# EAGLE design aquarium.computer (EAGLE 6.5.0)
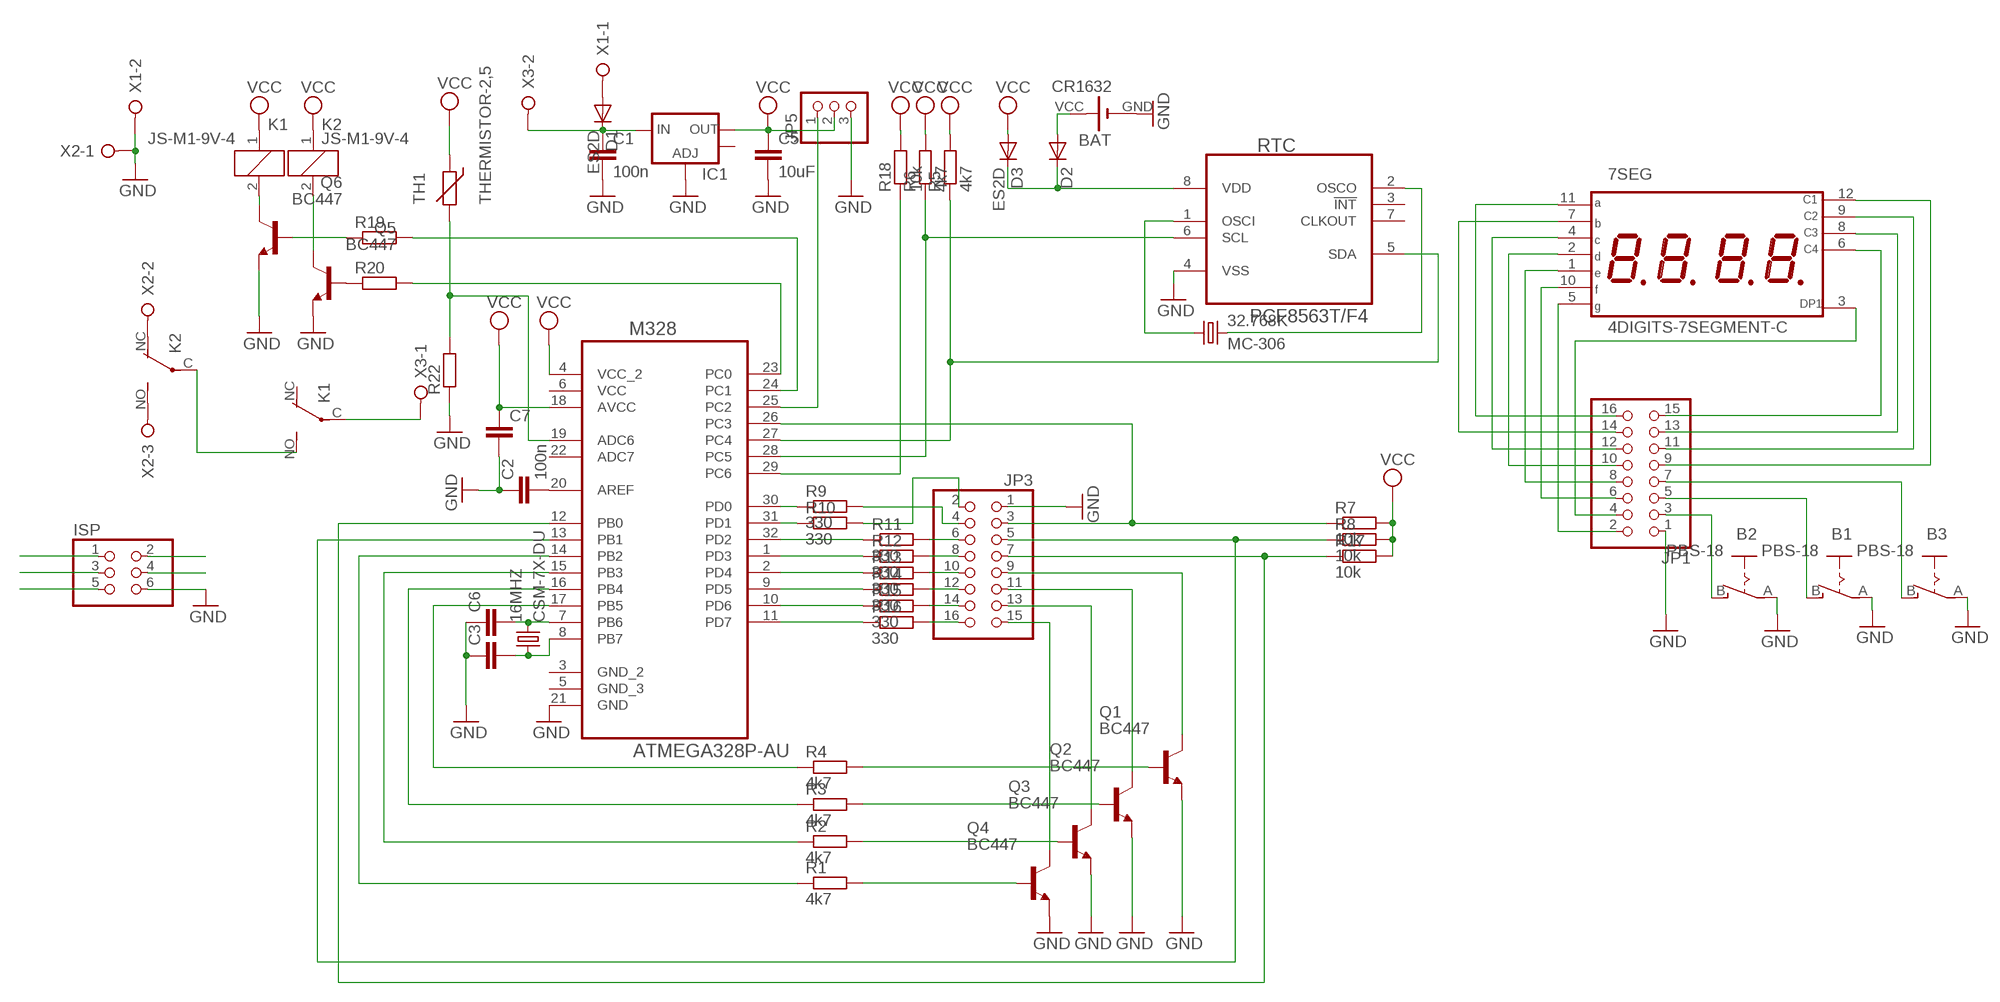
[diagram p0: schematic, sheet 1]

## Parts
7SEG  4DIGITS-7SEGMENT-C  [CC56-12EWA]
16MHZ  CSM-7X-DU  [CSM-7X-DU]
32.768K  MC-306  [MC-306]
B1  PBS-18  [PBS18]
B2  PBS-18  [PBS18]
B3  PBS-18  [PBS18]
BAT  CR1632  [CR3232]
C1  100n  C-EU025-040X050  [C025-040X050]
C2  100n  C-EUC1206  [C1206]
C3  C-EUC0805K  [C0805K]
C5  10uF  C-EU025-050X050  [C025-050X050]
C6  C-EUC0805K  [C0805K]
C7  C-EU025-040X050  [C025-040X050]
D1  ES2D  [SMB]
D2  DIODE-SOD80C  [SOD80C]
D3  ES2D  [SMB]
IC1  V_REG_LM1117SOT223  [SOT223]
ISP  PINHD-2X3  [2X03]
JP1  PINHD-2X8  [2X08]
JP3  PINHD-2X8  [2X08]
JP5  PINHD-1X3  [1X03]
K1  JS-M1-9V-4  [JS-M]
K2  JS-M1-9V-4  [JS-M]
M328  ATMEGA328P-AU  [QFP80P900X900X120-32N]
Q1  BC447  [TO92-EBC]
Q2  BC447  [TO92-EBC]
Q3  BC447  [TO92-EBC]
Q4  BC447  [TO92-EBC]
Q5  BC447  [TO92-EBC]
Q6  BC447  [TO92-EBC]
R1  4k7  R-EU_0207/10  [0207/10]
R2  4k7  R-EU_0207/10  [0207/10]
R3  4k7  R-EU_0207/10  [0207/10]
R4  4k7  R-EU_0207/10  [0207/10]
R5  4k7  R-EU_R1206  [R1206]
R6  4k7  R-EU_R1206  [R1206]
R7  10k  R-EU_0207/10  [0207/10]
R8  10k  R-EU_0207/10  [0207/10]
R9  330  R-EU_0207/10  [0207/10]
R10  330  R-EU_0207/10  [0207/10]
R11  330  R-EU_0207/10  [0207/10]
R12  330  R-EU_0207/10  [0207/10]
R13  330  R-EU_0207/10  [0207/10]
R14  330  R-EU_0207/10  [0207/10]
R15  330  R-EU_0207/10  [0207/10]
R16  330  R-EU_0207/10  [0207/10]
R17  10k  R-EU_0207/10  [0207/10]
R18  10k  R-EU_0207/10  [0207/10]
R19  R-EU_0207/10  [0207/10]
R20  R-EU_0207/10  [0207/10]
R22  R-EU_R1206  [R1206]
RTC  PCF8563T/F4  [SOIC127P600X175-8N]
TH1  THERMISTOR-2,5  [RS-2,5]
X1  W237-02P  [W237-132]
X2  W237-3E  [W237-3E]
X3  W237-02P  [W237-132]

## Nets
GND: B1.A(P) B2.A(P) B3.A(P) BAT.GND(-) C1.2 C2.1 C3.1 C5.2 C6.1 C7.2 IC1.1(ADJ) ISP.6 JP1.1 JP3.1 JP5.3 M328.21(GND) Q1.E Q2.E Q3.E Q4.E Q5.E Q6.E R22.1 RTC.4(VSS) X1.2 X2.1
MISO: ISP.1 M328.16(PB4) R3.1
MOSI: ISP.4 M328.15(PB3) R2.1
N$1: M328.28(PC5) R6.1 RTC.6(SCL)
N$2: M328.27(PC4) R5.1 RTC.5(SDA)
N$3: Q5.B R20.1
N$4: Q1.B R4.2
N$5: Q2.B R3.2
N$6: Q3.B R2.2
N$7: M328.31(PD1) R10.1
N$8: M328.32(PD2) R11.1
N$9: M328.1(PD3) R12.1
N$10: M328.2(PD4) R13.1
N$11: M328.9(PD5) R14.1
N$12: K1.C(2:P) X3.1
N$13: M328.10(PD6) R15.1
N$14: M328.11(PD7) R16.1
N$15: JP3.7 M328.12(PB0) R17.1
N$16: M328.14(PB2) R1.1
N$17: JP3.2 R10.2
N$18: 32.768K.1 RTC.1(OSCI)
N$19: 32.768K.4 RTC.2(OSCO)
N$20: JP3.4 R9.2
N$22: JP3.6 R11.2
N$23: JP3.8 R12.2
N$24: JP3.10 R13.2
N$25: JP3.12 R14.2
N$26: JP3.14 R15.2
N$27: JP3.16 R16.2
N$28: Q4.B R1.2
N$29: M328.30(PD0) R9.1
N$30: 16MHZ.2 C6.2 M328.7(PB6)
N$31: 16MHZ.1 C3.2 M328.8(PB7)
N$32: 7SEG.11(A) JP1.16
N$33: M328.23(PC0) R20.2
N$34: M328.24(PC1) R19.2
N$35: JP3.3 M328.26(PC3) R7.1
N$36: M328.19(ADC6) R22.2 TH1.2
N$37: JP3.5 M328.13(PB1) R8.1
N$38: JP3.11 Q2.C
N$39: JP3.9 Q1.C
N$40: K2.2 Q5.C
N$41: K1.2 Q6.C
N$42: K1.NO(2:S) K2.C(2:P)
N$43: BAT.VCC(+) D2.A
N$44: 7SEG.7(B) JP1.14
N$45: K2.NC(2:O) X2.2
N$46: K2.NO(2:S) X2.3
N$47: Q6.B R19.1
N$49: B2.B(S) JP1.3
N$50: B1.B(S) JP1.5
N$51: B3.B(S) JP1.7
N$52: 7SEG.10(F) JP1.6
N$53: 7SEG.4(C) JP1.12
N$54: 7SEG.2(D) JP1.10
N$55: 7SEG.1(E) JP1.8
N$56: 7SEG.5(G) JP1.2
N$57: 7SEG.6(C4) JP1.15
N$58: 7SEG.12(C1) JP1.9
N$59: 7SEG.9(C2) JP1.11
N$60: 7SEG.8(C3) JP1.13
N$61: 7SEG.3(DP1) JP1.4
N$62: JP3.15 Q4.C
N$63: JP3.13 Q3.C
N$66: C2.2 M328.20(AREF)
N$67: D2.C D3.C RTC.8(VDD)
N$68: JP5.1 M328.25(PC2)
N$73: C1.1 D1.C IC1.3(IN) X3.2
N$74: D1.A X1.1
RESET: ISP.5 M328.29(PC6) R18.1
SCK: ISP.3 M328.17(PB5) R4.1
VCC: C5.1 C7.1 D3.A IC1.2(OUT) ISP.2 JP5.2 K1.1 K2.1 M328.4(VCC_2) M328.18(AVCC) R5.2 R6.2 R7.2 R8.2 R17.2 R18.2 TH1.1
Unconnected: IC1.4(OUT) K1.NC(2:O) M328.3(GND_2) M328.5(GND_3) M328.22(ADC7) RTC.3(!INT) RTC.7(CLKOUT)

## Power pins joined to a net without a drawn wire
VCC: M328.6(VCC)

## Library data of the parts
7SEG = display-kingbright:4DIGITS-7SEGMENT-C
16MHZ = quarz:CSM-7X-DU: SMD CRYSTAL Source: www.ecsxtal.com .. Crystal 3.6864MHz CSM_7X_DU.PDF; OC_FARNELL: unknown; OC_NEWARK: unknown
32.768K = quarz:MC-306: kHz RANGE CRYSTAL UNIT SMD Source: MC-306_405_406_E07X.PDF Homepage <www.epsontoyocom.co.jp>; MPN: MC-306 60.0KHZ 100PPM ,12.5PF; OC_FARNELL: 1278040; OC_NEWARK: 31M5576
B1-B3 = switch:PBS-18
BAT = battery:CR1632
C1-C3 C5-C7 = rcl:C-EU: CAPACITOR, European symbol
D1 D3 = diode:ES2D: DIODE super fast rectifier, 2 A
D2 = diode:DIODE-: DIODE
IC1 = sparkfun:V_REG_LM1117: Voltage Regulator LM1117 Standard adjustable voltage regulator but in SMD form. Spark Fun Electronics SKU : COM-00595
ISP = pinhead:PINHD-2X3: PIN HEADER
JP1 JP3 = pinhead:PINHD-2X8: PIN HEADER
JP5 = pinhead:PINHD-1X3: PIN HEADER
K1 K2 = relay:JS-M1*: Automotive Ultra-Miniature Power Relay NAiS Source: http://www.mew-europe.com/.. en_ds_61211_0000.pdf; OC_FARNELL: unknown; OC_NEWARK: unknown
M328 = atmega328:ATMEGA328P-AU: 8-bit Microcontroller with In-System Programmable Flash; MPN: ATMEGA328P-AU; OC_FARNELL: 1715486; OC_NEWARK: 14R4631; PACKAGE: TQFP-32; SUPPLIER: Atmel
Q1-Q6 = transistor-npn:BC447*: NPN Transistor
R1-R20 R22 = rcl:R-EU_: RESISTOR, European symbol
RTC = pcf8563:PCF8563T/F4: IC, RTC/CALENDAR, SMD, 8563, SOIC8; MPN: PCF8563T/F4; OC_FARNELL: 2064561; OC_NEWARK: 71T7091; PACKAGE: SOIC-8; SUPPLIER: NXP Semiconductors
TH1 = varistor:THERMISTOR: THERMISTOR
X1 X3 = con-wago-508:W237-02P: WAGO SREW CLAMP; OC_FARNELL: unknown; OC_NEWARK: unknown
X2 = con-wago-508:W237-3E: WAGO SREW CLAMP; OC_FARNELL: unknown; OC_NEWARK: unknown

## Net classes
0 default: width 0.406 mm, drill 0.406 mm, clearance 0.406 mm
1 GND: width 0.61 mm, drill 0.61 mm, clearance 0.61 mm

## Board
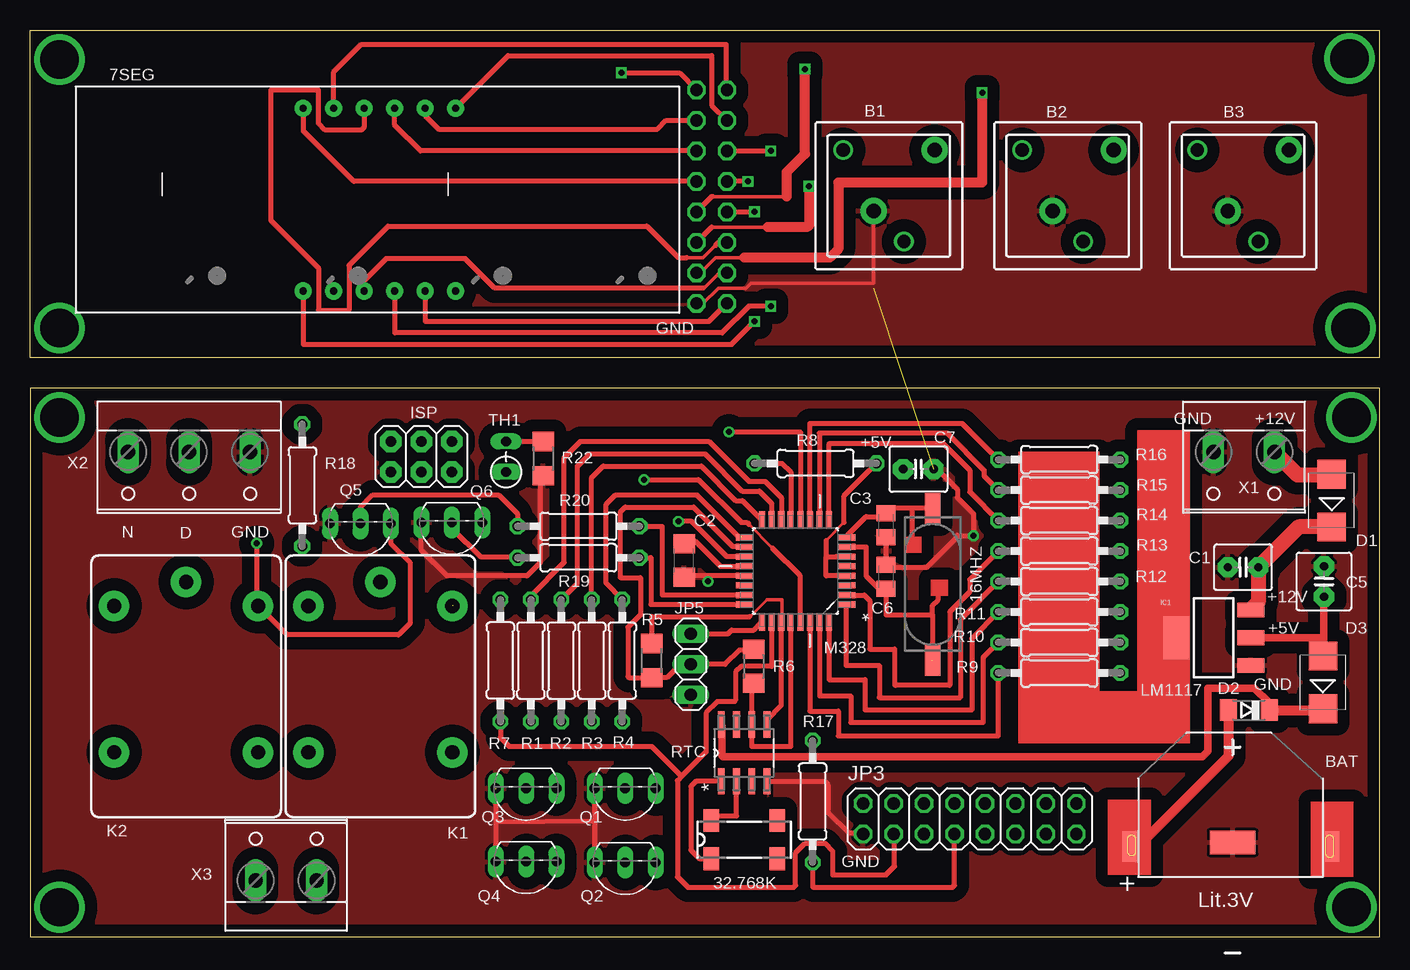
[diagram p1: board, top side]
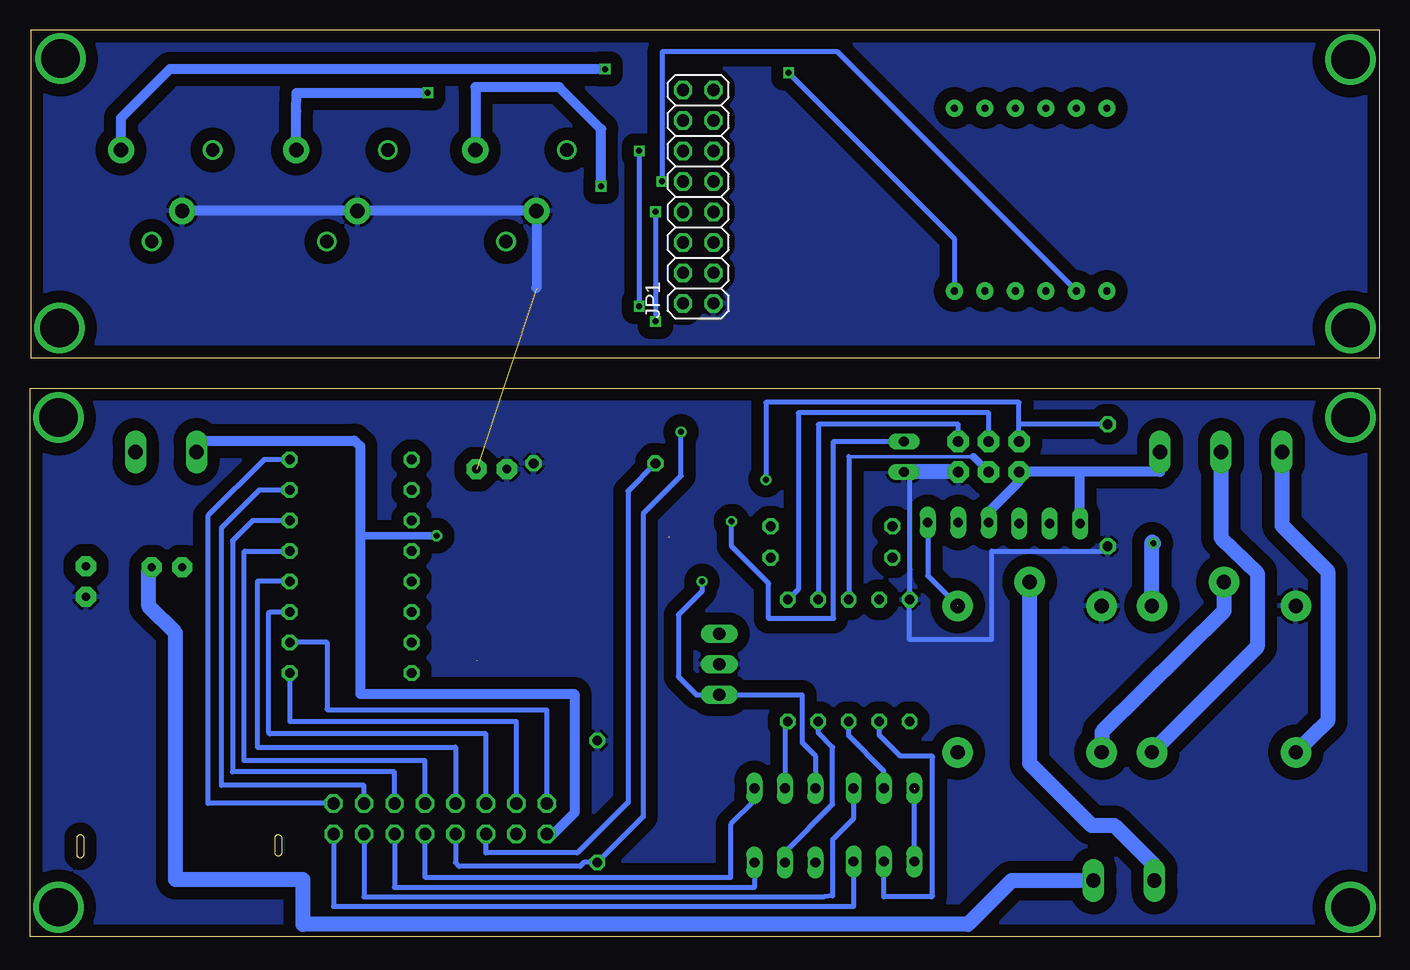
[diagram p2: board, bottom side, seen from below]

Size 112.54 x 75.56 mm. Coordinates in mm from the lower left corner, seen from the top.
Outline: 0,0 112.54,0 112.54,45.71 0,45.71 0,0
Outline: 0,48.26 0,75.57 112.47,75.57 112.47,48.26 0,48.26
Copper layers (1*16): Top 0.035mm / dielectric 1.5mm / Bottom 0.035mm
Design rules "default": minimum track width 10mil, minimum drill 24mil, track to track 8mil, track to pad 8mil, pad to pad 8mil, via to via 8mil, smd to smd 8mil, copper to edge 40mil, drill to drill 8mil, minimum pad ring 10mil, minimum via ring 8mil, stop-mask expansion 4mil, vias tented up to drill 0mil, thermal gap 10mil

### Footprints (pad centres in the part's own frame; a part is rotated, then mirrored left to right if it is on the bottom)
CC56-12EWA = drill 0.6 pad 1.422: 1 13.97,-5.715; 2 16.51,-5.715; 3 19.05,-5.715; 4 21.59,-5.715; 5 24.13,-5.715; 6 26.67,-5.715; 7 26.67,9.525; 8 24.13,9.525; 9 21.59,9.525; 10 19.05,9.525; 11 16.51,9.525; 12 13.97,9.525
CSM-7X-DU = smd 2.54 x 1.27: 1 -6.338,0; 2 6.338,0
MC-306 = smd 1.3 x 1.9: 1 -2.75,-1.6; 2 2.75,-1.6; 3 2.75,1.6; 4 -2.75,1.6
PBS18 = drill 1.2 pad 2.184: A 0,0; B 5.095,5.075 | drill 1.1 pad 1.27: P$1 -2.54,5.08; P$2 2.54,-2.54
CR3232 = smd 3.81 x 1.93: GND 0,-0.953 | smd 1.27 x 2.54: VCC -8.572,-1.27; VCC1 8.255,-1.27
C025-040X050 = drill 0.7 pad 1.676 octagon: 1 -1.27,0; 2 1.27,0
C1206 = smd 1.6 x 1.8: 1 -1.4,0; 2 1.4,0
C0805K = smd 1.3 x 1.6: 1 -1,0; 2 1,0
C025-050X050 = drill 0.7 pad 1.676 octagon: 1 -1.27,0; 2 1.27,0
SMB = smd 2.4 x 2.4: A 2.2,0; C -2.2,0
SOD80C = smd 1.4 x 1.8: A 1.7,0; C -1.7,0
SOT223 = smd 1.219 x 2.235: 1 -2.311,-3.099; 2 0,-3.099; 3 2.311,-3.099 | smd 3.6 x 2.2: 4 0,3.099
2X03 = drill 0.9 pad 1.778 octagon: 1 -2.54,-1.27; 2 -2.54,1.27; 3 0,-1.27; 4 0,1.27; 5 2.54,-1.27; 6 2.54,1.27
2X08 = drill 1.016 octagon: 1 -8.89,-1.27; 2 -8.89,1.27; 3 -6.35,-1.27; 4 -6.35,1.27; 5 -3.81,-1.27; 6 -3.81,1.27; 7 -1.27,-1.27; 8 -1.27,1.27; 9 1.27,-1.27; 10 1.27,1.27; 11 3.81,-1.27; 12 3.81,1.27; 13 6.35,-1.27; 14 6.35,1.27; 15 8.89,-1.27; 16 8.89,1.27
1X03 = drill 1.016 long: 1 -2.54,0; 2 0,0; 3 2.54,0
JS-M = drill 1.2 pad 2.54: 1 6.7,6; 2 6.7,-6; C 8.7,0; NC -5.5,-6; NO -5.5,6
QFP80P900X900X120-32N = smd 1.473 x 0.508: 1 -4.242,2.794; 2 -4.242,2.007; 3 -4.242,1.194; 4 -4.242,0.406; 5 -4.242,-0.406; 6 -4.242,-1.194; 7 -4.242,-2.007; 8 -4.242,-2.794; 17 4.242,-2.794; 18 4.242,-2.007; 19 4.242,-1.194; 20 4.242,-0.406; 21 4.242,0.406; 22 4.242,1.194; 23 4.242,2.007; 24 4.242,2.794 | smd 0.508 x 1.473: 9 -2.794,-4.242; 10 -2.007,-4.242; 11 -1.194,-4.242; 12 -0.406,-4.242; 13 0.406,-4.242; 14 1.194,-4.242; 15 2.007,-4.242; 16 2.794,-4.242; 25 2.794,4.242; 26 2.007,4.242; 27 1.194,4.242; 28 0.406,4.242; 29 -0.406,4.242; 30 -1.194,4.242; 31 -2.007,4.242; 32 -2.794,4.242
TO92-EBC = drill 0.813 long: B 0,-1.27; C -2.54,-1.27; E 2.54,-1.27
0207/10 = drill 0.813 octagon: 1 -5.08,0; 2 5.08,0
R1206 = smd 1.6 x 1.803: 1 -1.422,0; 2 1.422,0
SOIC127P600X175-8N = smd 2.184 x 0.559: 1 -2.362,1.905; 2 -2.362,0.635; 3 -2.362,-0.635; 4 -2.362,-1.905; 5 2.362,-1.905; 6 2.362,-0.635; 7 2.362,0.635; 8 2.362,1.905
RS-2,5 = drill 0.813 long: 1 -1.27,0; 2 1.27,0
W237-132 = drill 1.194 long: 1 -2.54,-0.635; 2 2.54,-0.635
W237-3E = drill 1.194 long: 1 -5.08,-0.635; 2 0,-0.635; 3 5.08,-0.635

### Placement (x,y rotation side)
7SEG  8.81,59.53 0 top
16MHZ  75.25,29.37 270 top
32.768K  59.53,8.1 0 top
B1  70.33,60.48 0 top
B2  85.25,60.48 0 top
B3  99.85,60.48 0 top
BAT  100.25,8.81 0 top
C1  101.12,30.8 180 top
C2  54.53,31.35 90 top
C3  71.36,34.29 90 top
C5  107.87,29.61 90 top
C6  71.36,30 270 top
C7  74.06,38.97 0 top
D1  108.51,36.35 90 top
D2  101.6,18.89 180 top
D3  107.79,21.19 90 top
IC1  98.66,24.92 90 top
ISP  32.62,40 180 top
JP1  56.83,61.67 90 bottom
JP3  78.34,9.84 0 top
JP5  55.09,22.7 270 top
K1  29.21,20.88 90 top
K2  13.02,20.88 90 top
M328  63.82,30.48 180 top
Q1  49.61,11.11 180 top
Q2  49.61,4.92 180 top
Q3  41.35,11.11 180 top
Q4  41.35,5 180 top
Q5  27.54,33.18 180 top
Q6  35.16,33.26 180 top
R1  41.75,23.02 270 top
R2  44.29,23.02 270 top
R3  46.83,23.02 270 top
R4  49.37,23.02 270 top
R5  51.83,23.02 270 top
R6  60.33,22.54 90 top
R7  39.21,23.02 90 top
R8  65.48,39.45 0 top
R9  85.8,21.99 0 top
R10  85.8,24.53 0 top
R11  85.8,27.07 0 top
R12  85.8,29.61 0 top
R13  85.8,32.15 0 top
R14  85.8,34.69 0 top
R15  85.8,37.23 0 top
R16  85.8,39.77 0 top
R17  65.25,11.27 90 top
R18  22.7,37.62 270 top
R19  45.72,31.59 0 top
R20  45.72,34.21 0 top
R22  42.78,39.85 90 top
RTC  59.53,15.32 90 top
TH1  39.69,40 90 top
X1  101.2,39.77 180 top
X2  13.26,39.77 180 top
X3  21.35,5.32 0 top

### Tracks (layer width: path | path; a pad name or v marks a point on that pad's centre or on a via)
GND  (via drill 0.5 pad 0.61)  (2 unrouted)
  Top 0.305: JP1.1 56.12,52.78 57.39,54.05 59.69,54.05 60.09,54.45 70.33,54.45 B1.A
  Top 0.406: 38.81,9.6 Q4.E | Q1.E 47.07,9.68 | 47.07,9.68 Q2.E | Q3.E 38.81,9.6 | 38.81,9.6 47.07,9.68 | 54.82,30.24 C2.1 54.65,30.07 56.51,30.07 | RTC.4 66.26,12.96 66.52,12.7 66.52,10.4 68.26,8.65 69.37,8.65 JP3.1 | Q6.E 32.62,32.23 34.77,30.08 41.43,30.08 42.54,31.19 42.54,38.19 R22.1 | M328.21 56.51,30.07 | v56.51,29.61 56.51,30.07 | C7.2 75.64,38.97 77.31,37.31 77.31,36.59 78.66,35.24 v78.66,33.42 77.39,33.42 | 77.31,33.5 77.39,33.42 | C3.1 71.36,30.88 71.28,30.8 74.77,30.8 77.39,33.42
  Bottom 0.406: Q1.E 47.07,15.08 48.18,16.19 48.18,20.16 JP5.3 56.99,20.16 58.5,21.67 58.5,26.83 56.51,28.81 v56.51,29.61 | 38.81,6.19 38.81,12.3
  Bottom 0.61: v78.66,33.42 85.01,33.42
  Bottom 0.813: X1.2 98.66,41.35 85.49,41.35 85.01,40.88 85.01,33.42 85.01,20.24 67.15,20.24 67.15,10.32 68.9,8.57 JP3.1 | X2.1 18.34,38.74 25,38.74 | Q5.E 25,38.74 | B3.A B2.A B1.A 70.33,54.05 | Q6.E 32.62,35.4 30.16,37.86 30.16,38.66 ISP.6 25,38.74
  pour Top (isolate 1.016): 0.24,45.4 112.32,45.48 112.39,0.16 0.24,0.16
  pour Bottom (isolate 1.016): 0.24,75.17 112,75.25 112,48.34 0.63,48.26 0.63,73.1
  pour Top (isolate 1.016): 0.24,75.33 111.92,75.41 111.84,48.26 0.16,48.18
MISO
  Top 0.406: R3.1 46.83,38.26 47.78,39.21 55.96,39.21 58.82,36.35 59.39,36.35 M328.16
  Bottom 0.406: ISP.1 35.16,42.7 46.83,42.7 R3.1
MOSI
  Top 0.406: R2.1 45.64,29.45 45.64,39.21 46.67,40.24 56.28,40.24 59.37,37.15 60.8,37.15 61.83,36.12 61.83,34.74 M328.15
  Bottom 0.305: 44.29,40.01 33.89,40.01
  Bottom 0.406: 44.29,40.01 R2.1
  Bottom 0.61: ISP.4 33.89,40.01
N$1
  Top 0.406: M328.28 63.42,15.88 60.17,15.88 RTC.6 60.17,20.96 R6.1
N$2
  Top 0.254: 60.01,26.67 61.44,28.1
  Top 0.305: 61.44,28.1 62.71,28.1 62.71,26.56 M328.27
  Top 0.406: M328.27 62.62,19.29 61.44,18.1 RTC.5 | 60.01,26.67 51.83,26.67 R5.1
N$3
  Top 0.406: Q5.B 27.54,35.8 28.57,36.83 39.05,36.83 40.64,35.24 R20.1
N$4
  Bottom 0.406: R4.2 49.61,17.94 Q1.B
N$5
  Bottom 0.406: Q2.B 49.61,7.06 45.64,11.03 45.64,15.8 46.83,16.99 R3.2
N$6
  Bottom 0.406: Q3.B 41.35,13.81 44.29,16.75 R2.2
N$7
  Top 0.406: M328.31 65.82,20.08 68.42,20.08 68.42,17.86 79.45,17.86 79.45,23.26 R10.1
N$8
  Top 0.406: M328.32 66.61,21.43 69.61,21.43 69.61,18.89 78.5,18.89 78.5,24.84 R11.1
N$9
  Top 0.406: M328.1 68.02,27.65 68.02,22.62 70.8,22.62 70.8,19.92 77.55,19.92 77.55,26.43 R12.1
N$10
  Top 0.406: 67.56,28.5 M328.2 69.55,28.47 70.01,28.02 70.01,23.97 72.07,23.97 72.07,21.03 72.15,20.96 76.68,20.96 76.68,27.07 78.34,28.73 78.34,29.77 R13.1
N$11
  Top 0.406: M328.9 66.61,41.05 66.67,41.12 76.12,41.12 78.34,38.89 78.34,37.07 R14.1
N$12
  Bottom 1.27: K1.C 29.21,14.45 24.05,9.29 22.15,9.29 18.81,5.95 X3.1
N$13
  Top 0.406: M328.10 65.8,34.82 65.8,41.99 76.44,41.99 79.53,38.89 79.53,38.42 R15.1
N$14
  Top 0.406: M328.11 65.01,41.83 65.01,42.39 65.01,42.78 77.71,42.78 R16.1
N$15  (via drill 0.5 pad 0.41)
  Top 0.406: v58.26,42.07 64.22,42.07 M328.12 | R17.1 65.25,4.21 65.33,4.13 76.91,4.13 77.07,4.29 JP3.7
  Bottom 0.406: JP3.7 77.07,6.19 76.76,5.87 66.67,5.87 66.36,6.19 R17.1 61.44,10 61.44,35.24 58.26,38.42 v58.26,42.07
N$16
  Top 0.406: R1.1 41.75,28.42 44.53,31.19 44.53,39.93 45.88,41.28 56.59,41.28 59.92,37.94 61.27,37.94 62.63,36.59 M328.14
N$17
  Bottom 0.406: JP3.2 69.45,18.89 87.71,18.89 87.79,18.97 87.79,24.53 R10.2
N$18
  Top 0.406: RTC.1 55.5,12.96 55.09,12.54 55.09,7.22 55.8,6.51 56.77,6.51 32.768K.1
N$19
  Top 0.406: RTC.2 58.9,10.07 56.83,10.07 32.768K.4
N$20
  Bottom 0.406: JP3.4 71.99,17.94 90.88,17.94 R9.2
N$21  (via drill 3.2 pad 1.42)
  other vias: 2.46,2.46
N$22
  Bottom 0.406: JP3.6 74.53,16.91 92.55,16.91 92.63,16.99 92.63,26.99 92.55,27.07 R11.2
N$23
  Bottom 0.406: R12.2 93.58,29.61 93.58,15.8 77.07,15.8 JP3.8
N$24
  Bottom 0.406: R13.2 94.61,32.15 94.69,32.07 94.69,14.68 79.61,14.68 JP3.10
N$25
  Bottom 0.406: JP3.12 82.15,13.73 95.65,13.73 95.65,33.02 93.98,34.69 R14.2
N$26
  Bottom 0.406: JP3.14 84.69,12.62 96.6,12.62 96.6,34.05 93.42,37.23 R15.2
N$27
  Bottom 0.406: JP3.16 97.71,11.11 97.71,35.08 93.03,39.77 R16.2
N$28
  Bottom 0.406: Q4.B 41.35,3.33 37.39,3.33 37.31,3.41 37.31,15 37.39,15.08 40,15.08 41.75,16.83 R1.2
N$29
  Top 0.406: R9.1 80.72,16.75 67.39,16.75 67.39,18.81 65.01,18.81 M328.30
N$30  (1 unrouted)
  Top 0.406: M328.7 68.08,32.46 69.69,32.46 69.69,30.08 70.8,28.97 71.33,28.97 C6.2 | 71.07,29.29 C6.2 | 75.25,26.83 75.25,23.02 | C6.2 71.36,26.83 75.25,26.83 | 75.25,26.83 75.25,27.62 75.72,28.1 75.72,29.21
N$31
  Top 0.406: M328.8 68.06,33.37 69.69,35 71.96,35 C3.2 71.79,35.72 73.58,35.72 | 75.25,35.32 16MHZ.1 73.59,35.71 73.58,35.72 | 73.58,32.7 73.58,35.72
N$32
  Top 0.406: 7SEG.11 25.32,72.07 27.62,74.37 58.02,74.37 58.02,70.64 JP1.16
N$33
  Top 0.406: M328.23 59.55,28.5 52.7,28.5 52.7,34.21 R20.2
N$34
  Top 0.406: M328.24 58.72,27.7 51.75,27.7 51.75,31.59 R19.2
N$35
  Top 0.406: M328.26 61.83,26.22 61.83,22.54 59.29,22.54 58.82,22.07 58.82,19.76 58.74,19.61 57.31,19.61 56.36,18.65 56.36,15.4 54.33,13.37 | 54.33,13.37 53.97,13.02 53.97,5 54.85,4.13 63.66,4.13 63.82,4.29 63.82,6.99 64.61,7.78 66.28,7.78 66.91,7.14 66.91,5.16 71.36,5.16 72.07,5.87 72.07,8.49 JP3.3 | R7.1 39.21,16.59 39.93,15.88 51.83,15.88 54.33,13.37
N$36  (via drill 0.5 pad 0.61)
  Top 0.406: M328.19 58.1,31.67 55.17,34.61 v54.05,34.61 | TH1.2 42.06,41.28 R22.2
  Bottom 0.406: v54.05,34.61 54.05,32.54 50.96,29.45 50.96,26.51 45.56,26.51 45.56,41.28 TH1.2
N$37
  Top 0.406: R8.1 62.71,39.45 63.42,38.74 M328.13
  Bottom 0.406: JP3.5 74.53,6.99 66.91,6.99 62.79,11.11 62.71,11.11 62.71,37.15 R8.1
N$38
  Bottom 0.406: JP3.11 82.15,4.13 52.15,4.13 Q2.C
N$39
  Bottom 0.406: Q1.C 52.15,11.35 54.13,9.37 54.13,4.92 79.53,4.92 79.61,5 JP3.9
N$40  (via drill 0.5 pad 0.61)
  Top 0.406: v18.89,32.78 18.89,27.7 K2.2 21.43,25.16 30.72,25.16 31.67,26.11 31.67,31.19 30.08,32.78 Q5.C
  Bottom 1.27: K2.2 19.02,32.91 v18.89,32.78
N$41  (1 unrouted)
  Bottom 0.406: Q6.C 37.7,30.08 35.24,27.62
N$42
  Bottom 1.27: K2.C 13.02,27.15 23.18,17.07 23.18,15.41 K1.NO
N$43
  Top 0.813: BAT.VCC 92.39,7.54 99.93,15.08 99.93,18.86 D2.A
N$44
  Top 0.406: 7SEG.7 39.85,73.42 56.83,73.42 56.83,69.29 JP1.14
N$45
  Bottom 1.27: X2.2 13.26,33.26 10.24,30.32 10.24,24.15 K2.NC
N$46
  Bottom 1.27: X2.3 8.18,34.29 4.37,30.48 4.37,17.95 K2.NO
N$47
  Top 0.406: Q6.B 35.16,34.05 37.54,31.67 40.56,31.67 R19.1
N$48  (via drill 3.2 pad 1.42)
  other vias: 110.17,2.46
N$49  (via drill 0.5 pad 0.41)
  Top 0.305: 55.88,55.32 57.15,56.59 59.53,56.59
  Top 0.406: JP1.3 55.88,55.32
  Top 0.813: v79.37,70.33 79.37,62.87 67.39,62.87 67.39,57.31 66.67,56.59 59.53,56.59
  Bottom 0.813: B2.B 90.34,68.8 90.33,70.33 v79.37,70.33
N$50  (via drill 0.5 pad 0.41)
  Top 0.305: 56.83,59.13 61.52,59.13
  Top 0.406: JP1.5 56.83,59.13
  Top 0.813: v64.93,62.55 64.93,59.21 64.77,59.13 61.52,59.13
  Bottom 0.813: B1.B 75.41,65.57 75.41,70.8 68.42,70.8 64.93,67.31 v64.93,62.55
N$51  (via drill 0.5 pad 0.41)
  Top 0.305: 63.1,61.67 56.91,61.67
  Top 0.406: 56.91,61.67 56.83,61.67 JP1.7
  Top 0.813: 63.1,61.67 63.1,63.74 64.61,65.25 v64.61,72.31
  Bottom 0.813: B3.B 104.95,68.25 100.89,72.31 v64.61,72.31
N$52
  Top 0.305: 54.77,56.59 56.12,56.59 57.15,57.63
  Top 0.406: 7SEG.10 27.86,67.47 27.62,67.23 24.61,67.23 24.05,67.79 24.05,70.56 20.08,70.56 20.08,59.69 24.05,55.72 24.05,52.23 26.59,52.23 26.59,55.96 29.84,59.21 51.43,59.21 54.05,56.59 54.77,56.59 | 57.15,57.63 57.39,57.86 JP1.6
N$53  (via drill 0.5 pad 0.41)
  Top 0.406: JP1.12 v61.75,65.48 | v61.75,52.55 59.93,52.55 57.71,50.32 30.4,50.32 7SEG.4
  Bottom 0.406: v61.75,65.48 v61.75,52.55
N$54  (via drill 0.5 pad 0.41)
  Top 0.406: v59.85,62.94 JP1.10
  Bottom 0.406: v59.85,62.94 59.85,73.74 45.24,73.74 7SEG.2
N$55  (via drill 0.5 pad 0.41)
  Top 0.406: 7SEG.1 22.78,49.37 58.5,49.37 v60.4,51.28 | JP1.8 v60.4,60.4
  Bottom 0.406: v60.4,60.4 v60.4,51.28
N$56
  Top 0.406: JP1.2 56.59,51.28 32.94,51.28 7SEG.5
N$57  (via drill 0.5 pad 0.41)
  Top 0.406: v49.29,71.99 54.13,71.99 JP1.15
  Bottom 0.406: v49.29,71.99 35.48,58.18 7SEG.6
N$58
  Top 0.406: 7SEG.12 22.78,67.15 26.99,62.94 JP1.9
N$59
  Top 0.406: JP1.11 32.54,65.48 30.4,67.63 7SEG.9
N$60
  Top 0.406: 7SEG.8 32.94,68.42 34.05,67.31 52.31,67.31 53.02,68.02 JP1.13
N$61
  Top 0.305: 56.12,54.05 56.2,54.05 57.47,55.32 JP1.4
  Top 0.406: 7SEG.3 27.86,54.69 29.69,56.52 36.27,56.52 38.73,54.05 56.12,54.05
N$62
  Bottom 0.406: JP3.15 87.23,2.54 43.89,2.54 Q4.C
N$63
  Bottom 0.406: JP3.13 84.69,3.33 46.35,3.33 45.64,3.41 45.64,8.1 43.89,9.84 Q3.C
N$64  (via drill 3.2 pad 1.42)
  other vias: 2.46,43.26
N$65  (via drill 3.2 pad 1.42)
  other vias: 110.17,43.26
N$66
  Top 0.406: C2.2 54.4,32.99 55.43,32.99 57.55,30.88 M328.20
N$67
  Top 0.406: 103.27,18.92 D2.C
  Top 0.61: 103.27,18.92 103.27,19.53 102.08,20.72 98.19,20.72 98.19,15.48 97.71,15 57.78,15 57.71,15.08 57.71,17.6 RTC.8
  Top 0.813: D2.C 107.69,18.89 D3.C
N$68
  Top 0.406: M328.25 60.34,25.56 58.5,25.56 58.18,25.24 JP5.1
N$69  (via drill 3.2 pad 1.68)
  other vias: 2.46,73.1
N$70  (via drill 3.2 pad 1.68)
  other vias: 2.46,50.72
N$71  (via drill 3.2 pad 1.68)
  other vias: 110.09,50.72
N$72  (via drill 3.2 pad 1.68)
  other vias: 110.01,73.18
N$73
  Top 0.406: IC1.3 101.12,27.31
  Top 1.27: D1.C 105.75,34.15 C1.1 102.39,27.87 IC1.3
  Bottom 0.813: 102.47,30.48 C1.1
  Bottom 1.27: C1.1 102.63,30.56 102.63,27.54 100.41,25.32 100.41,4.76 89.77,4.76 89.77,1.03 34.37,1.03 30.72,4.68 X3.2
N$74
  Top 1.27: 108.05,38.18 D1.A 108.45,38.5 105.65,38.5 X1.1
RESET  (via drill 0.5 pad 0.61)
  Top 0.254: 61.91,32.39 59.93,34.37
  Top 0.406: M328.29 64.22,30.07 61.91,32.39 | 59.93,34.37 59.77,34.53 59.29,34.53 55.72,38.1 v51.2,38.1
  Bottom 0.406: R18.1 30.08,42.7 | ISP.5 30.08,42.7 | 30.08,42.7 30.08,44.53 51.2,44.53 v51.2,38.1
SCK  (1 unrouted)
  Top 0.406: 59.28,33.27 M328.17 59.56,33.26 | 59.29,33.34 59.05,33.34 55.56,36.83 48.82,36.83 48.02,36.04 48.02,29.45 R4.1
  Bottom 0.406: ISP.3 32.62,43.66 48.5,43.66 48.5,28.97 R4.1
VCC
  Top 0.254: 67.87,34.53 66.36,33.02
  Top 0.406: 66.36,33.02 66.36,31.67 | 66.36,31.67 67.19,31.67 M328.6 | 60.25,23.89 R6.2 59.6,23.89 59.13,23.89 57.94,22.7 JP5.2 54.21,22.7 53.1,21.59 R5.2 51.82,21.59 49.93,21.59 49.85,21.67 49.85,25.8 50.88,26.83 50.88,29.92 49.21,29.92 49.21,35.4 49.61,35.8 55.32,35.8 58.58,32.54 59.52,32.54 M328.18 | 67.87,34.53 67.87,36.75 R8.2 | M328.4 66.37,30.07 66.36,30.08 66.36,31.67
  Top 0.61: C5.1 107.87,25 | 107.87,25 107.87,23.47 D3.A | IC1.2 107.79,24.92 107.87,25
  Bottom 0.406: 39.13,38.58 38.97,38.74 | TH1.1 39.21,38.74 R7.2 39.21,24.77 32.38,24.77 32.38,32.15 22.7,32.15 R18.2
  Bottom 1.27: ISP.2 38.97,38.74 TH1.1
  pour Bottom (isolate 1.016): 0.32,45.48 112.32,45.32 112.39,0.24 0.48,0.32
(copper drawn outside any net)
  shapes: Top area x9

### Text on the board
tPlace: GND | GND | +12V | +5V | N | GND | D | +12V | +5V | GND | LM1117 | GND | +